# Altium project ECE453Tutorial.PrjPCB (part 1 of 2)
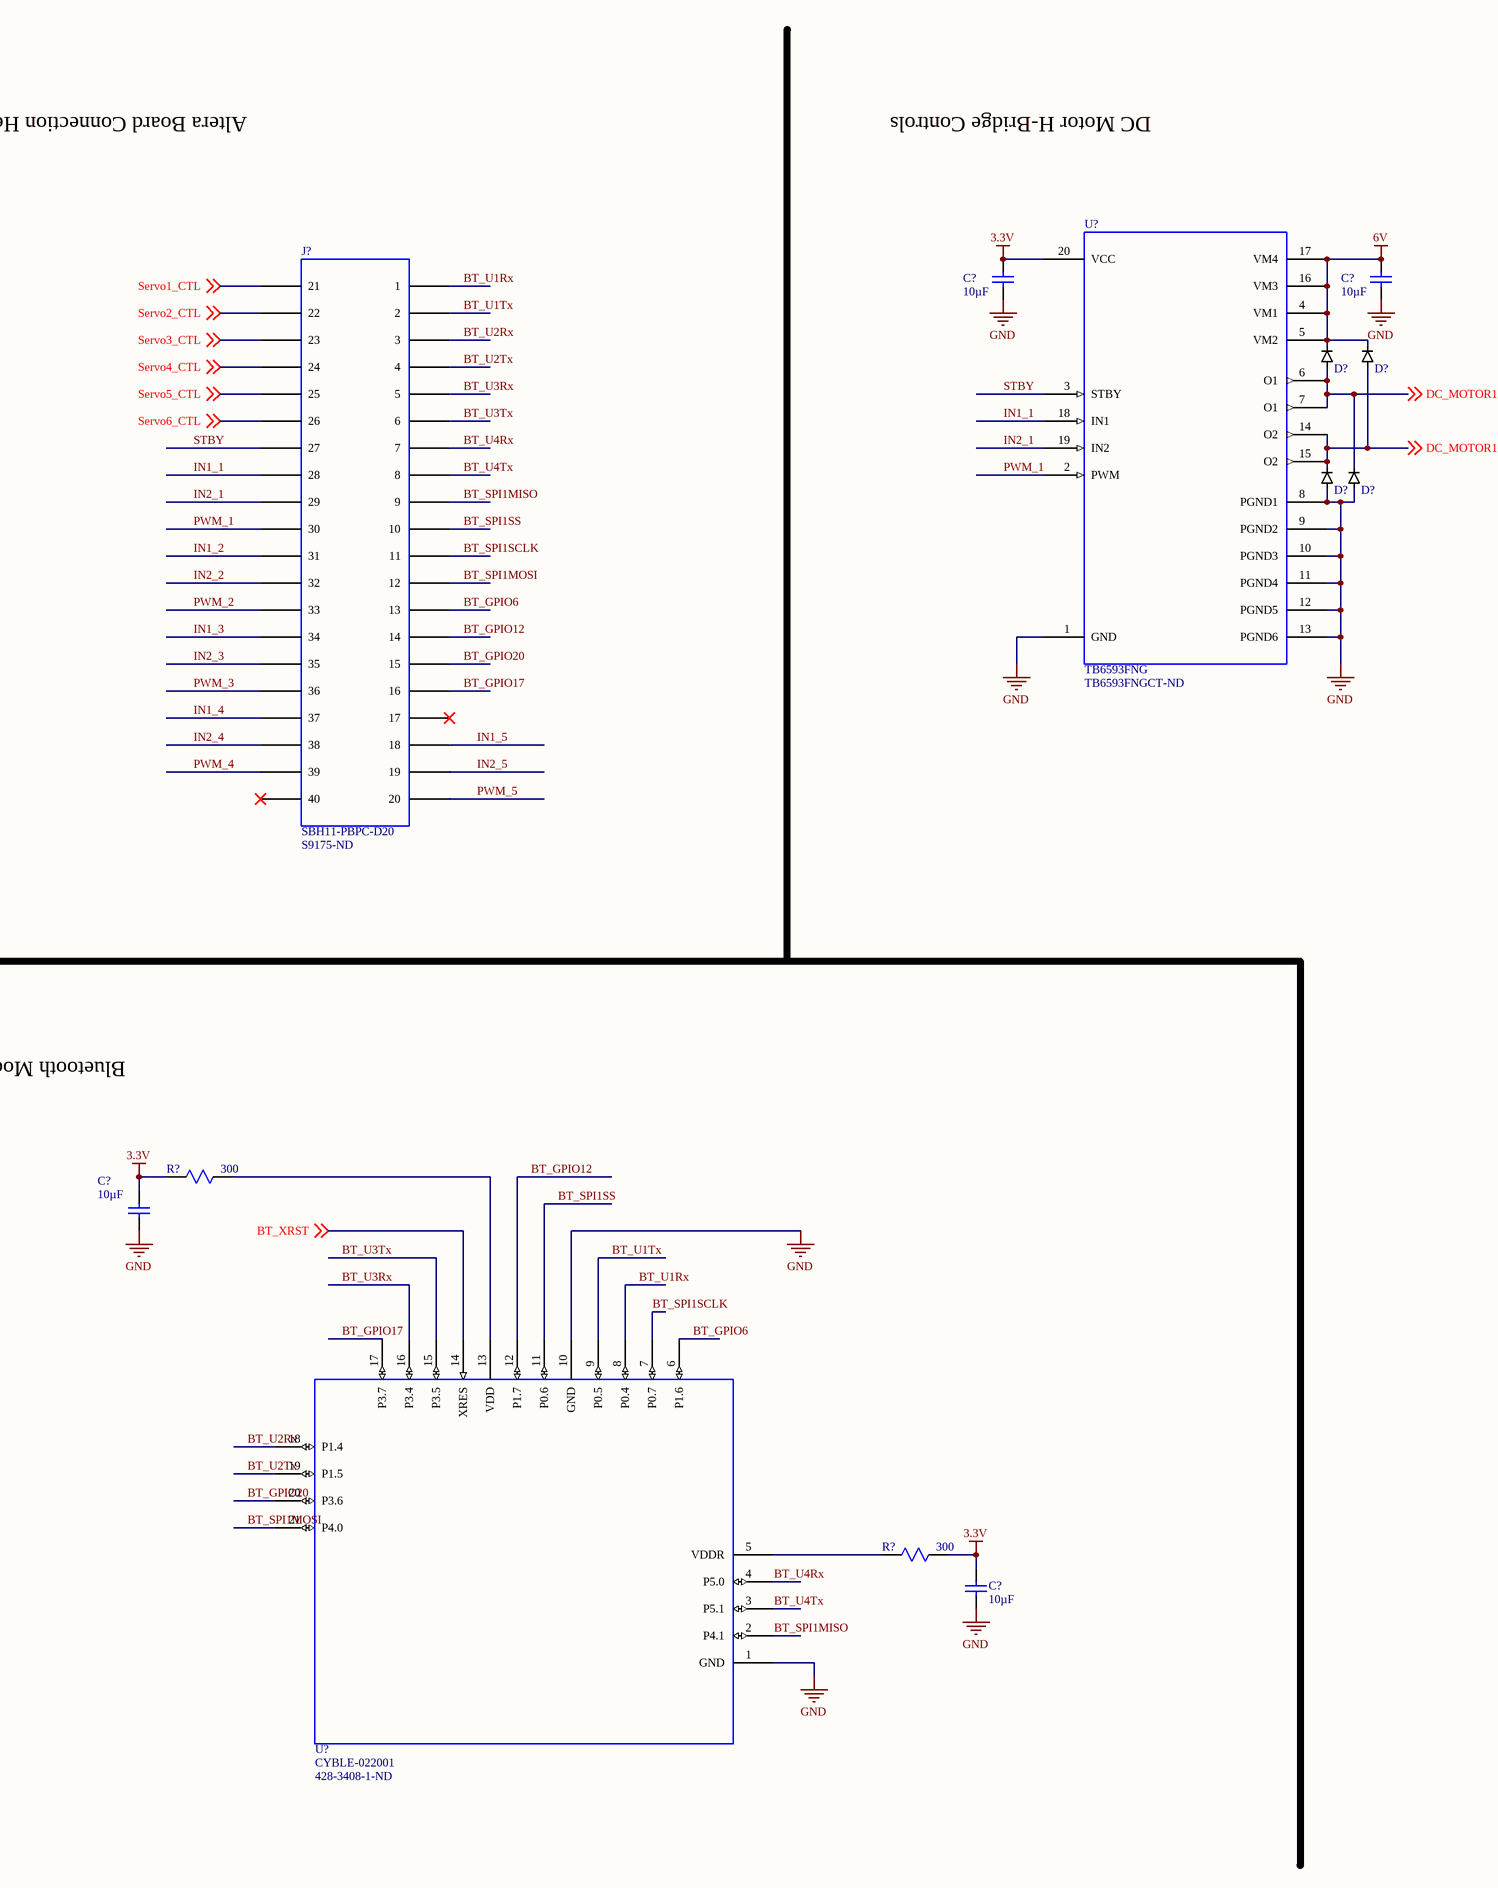
[diagram p0: 03 Arm Base Control Unit.SchDoc, left]
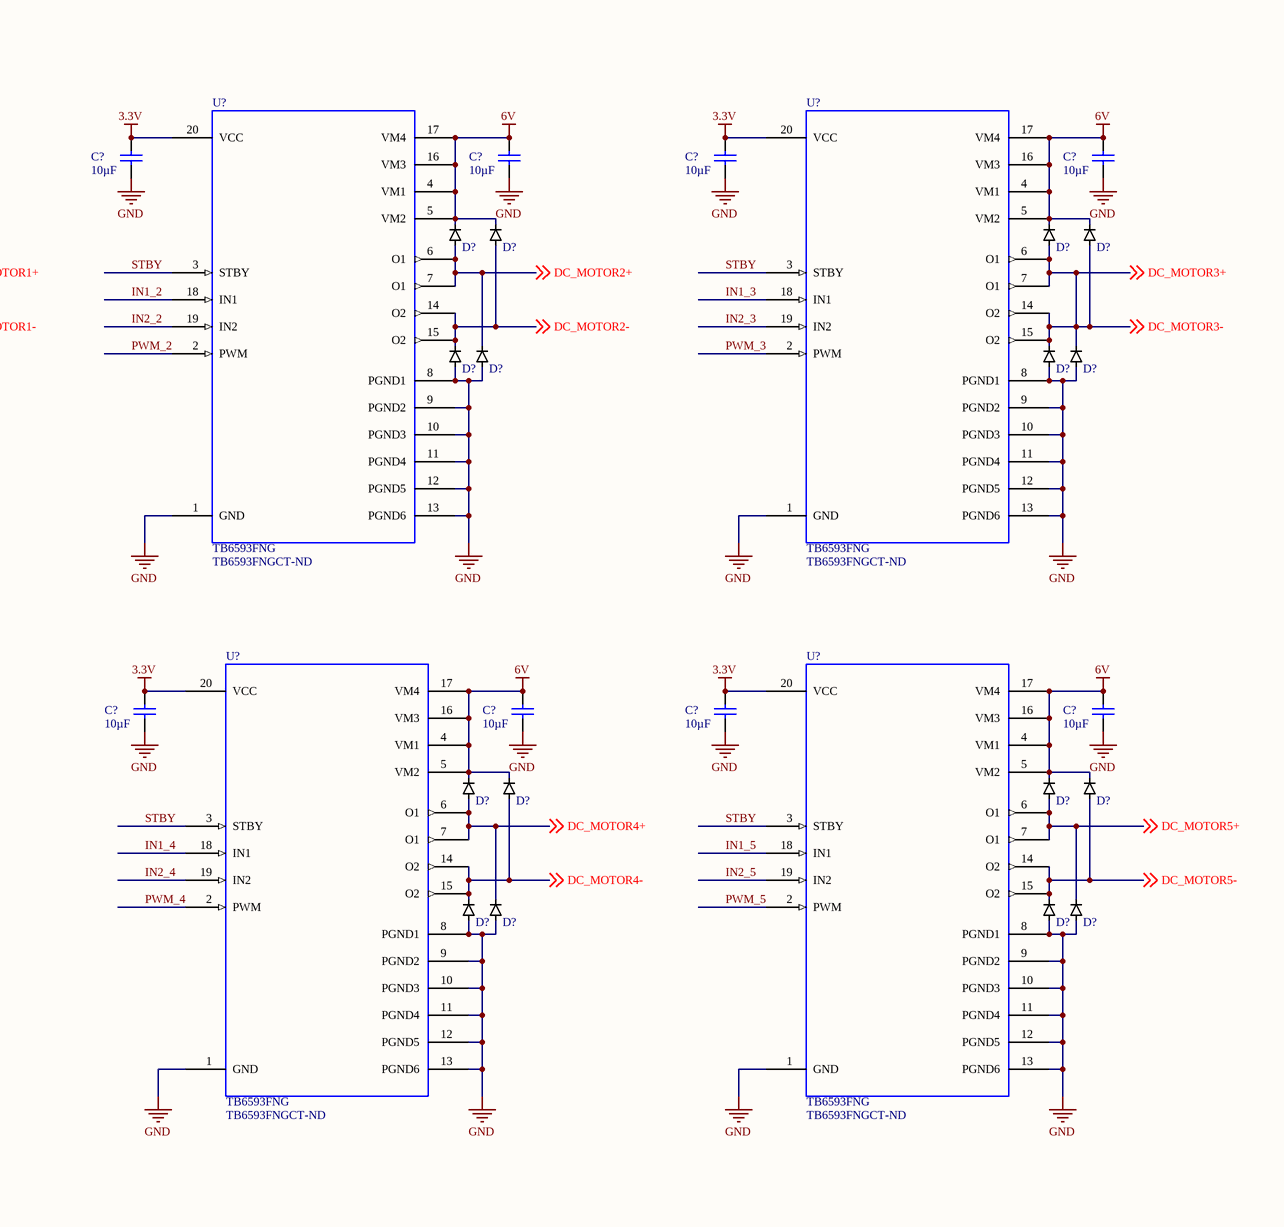
[diagram p1: 03 Arm Base Control Unit.SchDoc, right]
4 sheets, 150 parts. Net scope: global (net labels, ports and power ports of the same name join across sheets).
Board file: ECE453TutorialBoard.PcbDoc
Sheets:
  03 Arm Base Control Unit.SchDoc
  01 Revision History and Contents.SchDoc
  02 Motor Power Regulators and Connectors.SchDoc
  04 Glove Sensors.SchDoc

## Sheet 03 Arm Base Control Unit.SchDoc
size 558 x 355 mm

### Parts
(Parts that share a designator on the sheet are numbered #1, #2 ... from top to bottom, then left to right.)
C?#1  value 10µF  [CAP_0805]  (hidden comment: CAP_0805_U_010_00)
C?#2  value 10µF  [CAP_0805]  (hidden comment: CAP_0805_U_010_00)
C?#3  value 10µF  [CAP_0805]  (hidden comment: CAP_0805_U_010_00)
C?#4  value 10µF  [CAP_0805]  (hidden comment: CAP_0805_U_010_00)
C?#5  value 10µF  [CAP_0805]  (hidden comment: CAP_0805_U_010_00)
C?#6  value 10µF  [CAP_0805]  (hidden comment: CAP_0805_U_010_00)
C?#7  value 10µF  [CAP_0805]  (hidden comment: CAP_0805_U_010_00)
C?#8  value 10µF  [CAP_0805]  (hidden comment: CAP_0805_U_010_00)
C?#9  value 10µF  [CAP_0805]  (hidden comment: CAP_0805_U_010_00)
C?#10  value 10µF  [CAP_0805]  (hidden comment: CAP_0805_U_010_00)
C?#11  value 10µF  [CAP_0805]  (hidden comment: CAP_0805_U_010_00)
C?#12  value 10µF  [CAP_0805]  (hidden comment: CAP_0805_U_010_00)
D?#1  DB2W40100LCT-ND  (value not drawn)
D?#2  DB2W40100LCT-ND  (value not drawn)
D?#3  DB2W40100LCT-ND  (value not drawn)
D?#4  DB2W40100LCT-ND  (value not drawn)
D?#5  DB2W40100LCT-ND  (value not drawn)
D?#6  DB2W40100LCT-ND  (value not drawn)
D?#7  DB2W40100LCT-ND  (value not drawn)
D?#8  DB2W40100LCT-ND  (value not drawn)
D?#9  DB2W40100LCT-ND  (value not drawn)
D?#10  DB2W40100LCT-ND  (value not drawn)
D?#11  DB2W40100LCT-ND  (value not drawn)
D?#12  DB2W40100LCT-ND  (value not drawn)
D?#13  DB2W40100LCT-ND  (value not drawn)
D?#14  DB2W40100LCT-ND  (value not drawn)
D?#15  DB2W40100LCT-ND  (value not drawn)
D?#16  DB2W40100LCT-ND  (value not drawn)
D?#17  DB2W40100LCT-ND  (value not drawn)
D?#18  DB2W40100LCT-ND  (value not drawn)
D?#19  DB2W40100LCT-ND  (value not drawn)
D?#20  DB2W40100LCT-ND  (value not drawn)
J?#1  value SBH11-PBPC-D20  Supplier Part Number 1: S9175-ND  (hidden comment: SBH11-PBPC-D20-ST-BK)
R?#1  value 300  (hidden comment: RC0402JR-07300RL)
R?#2  value 300  (hidden comment: RC0402JR-07300RL)
U?#1  Supplier Part Number 1: TB6593FNGCT-ND  (hidden comment: TB6593FNG)
U?#2  Supplier Part Number 1: TB6593FNGCT-ND  (hidden comment: TB6593FNG)
U?#3  Supplier Part Number 1: TB6593FNGCT-ND  (hidden comment: TB6593FNG)
U?#4  Supplier Part Number 1: TB6593FNGCT-ND  (hidden comment: TB6593FNG)
U?#5  Supplier Part Number 1: TB6593FNGCT-ND  (hidden comment: TB6593FNG)
U?#6  value CYBLE-022001  Supplier Part Number 1: 428-3408-1-ND  (hidden comment: CYBLE-022001-00)

### Nets
3.3V: C?#1.2 C?#3.2 C?#5.2 C?#7.2 C?#9.2 C?#11.2 C?#12.2 R?#1.1 R?#2.2 U?#1.20(VCC) U?#2.20(VCC) U?#3.20(VCC) U?#4.20(VCC) U?#5.20(VCC)
6V: C?#2.2 C?#4.2 C?#6.2 C?#8.2 C?#10.2 D?#1.41 D?#2.41 D?#3.41 D?#4.41 D?#5.41 D?#6.41 D?#13.41 D?#14.41 D?#15.41 D?#16.41 U?#1.4(VM1) U?#1.5(VM2) U?#1.16(VM3) U?#1.17(VM4) U?#2.4(VM1) U?#2.5(VM2) U?#2.16(VM3) U?#2.17(VM4) U?#3.4(VM1) U?#3.5(VM2) U?#3.16(VM3) U?#3.17(VM4) U?#4.4(VM1) U?#4.5(VM2) U?#4.16(VM3) U?#4.17(VM4) U?#5.4(VM1) U?#5.5(VM2) U?#5.16(VM3) U?#5.17(VM4)  [project net Vout]
GND: C?#1.1 C?#2.1 C?#3.1 C?#4.1 C?#5.1 C?#6.1 C?#7.1 C?#8.1 C?#9.1 C?#10.1 C?#11.1 C?#12.1 D?#7.42 D?#8.42 D?#9.42 D?#10.42 D?#11.42 D?#12.42 D?#17.42 D?#18.42 D?#19.42 D?#20.42 U?#1.1(GND) U?#1.8(PGND1) U?#1.9(PGND2) U?#1.10(PGND3) U?#1.11(PGND4) U?#1.12(PGND5) U?#1.13(PGND6) U?#2.1(GND) U?#2.8(PGND1) U?#2.9(PGND2) U?#2.10(PGND3) U?#2.11(PGND4) U?#2.12(PGND5) U?#2.13(PGND6) U?#3.1(GND) U?#3.8(PGND1) U?#3.9(PGND2) U?#3.10(PGND3) U?#3.11(PGND4) U?#3.12(PGND5) U?#3.13(PGND6) U?#4.1(GND) U?#4.8(PGND1) U?#4.9(PGND2) U?#4.10(PGND3) U?#4.11(PGND4) U?#4.12(PGND5) U?#4.13(PGND6) U?#5.1(GND) U?#5.8(PGND1) U?#5.9(PGND2) U?#5.10(PGND3) U?#5.11(PGND4) U?#5.12(PGND5) U?#5.13(PGND6) U?#6.1(GND) U?#6.10(GND)  [project net BAT_GND]
BT_GPIO6: J?#1.13 U?#6.6(P1.6)
BT_GPIO12: J?#1.14 U?#6.12(P1.7)
BT_GPIO17: J?#1.16 U?#6.17(P3.7)
BT_GPIO20: J?#1.15 U?#6.20(P3.6)
BT_SPI1MISO: J?#1.9 U?#6.2(P4.1)
BT_SPI1MOSI: J?#1.12 U?#6.21(P4.0)
BT_SPI1SCLK: J?#1.11 U?#6.7(P0.7)
BT_SPI1SS: J?#1.10 U?#6.11(P0.6)
BT_U1Rx: J?#1.1 U?#6.8(P0.4)
BT_U1Tx: J?#1.2 U?#6.9(P0.5)
BT_U2Rx: J?#1.3 U?#6.18(P1.4)
BT_U2Tx: J?#1.4 U?#6.19(P1.5)
BT_U3Rx: J?#1.5 U?#6.16(P3.4)
BT_U3Tx: J?#1.6 U?#6.15(P3.5)
BT_U4Rx: J?#1.7 U?#6.4(P5.0)
BT_U4Tx: J?#1.8 U?#6.3(P5.1)
BT_XRST: U?#6.14(XRES) ; off-sheet BT_XRST
DC_MOTOR1+: D?#1.42 D?#8.41 U?#1.6(O1) U?#1.7(O1) ; off-sheet DC_MOTOR1+
DC_MOTOR1-: D?#2.42 D?#7.41 U?#1.14(O2) U?#1.15(O2) ; off-sheet DC_MOTOR1-
DC_MOTOR2+: D?#3.42 D?#10.41 U?#2.6(O1) U?#2.7(O1) ; off-sheet DC_MOTOR2+
DC_MOTOR2-: D?#4.42 D?#9.41 U?#2.14(O2) U?#2.15(O2) ; off-sheet DC_MOTOR2-
DC_MOTOR3+: D?#5.42 D?#6.42 D?#11.41 D?#12.41 U?#3.6(O1) U?#3.7(O1) U?#3.14(O2) U?#3.15(O2) ; off-sheet DC_MOTOR3+, off-sheet DC_MOTOR3-  [also labelled DC_MOTOR3-]
DC_MOTOR4+: D?#13.42 D?#18.41 U?#4.6(O1) U?#4.7(O1) ; off-sheet DC_MOTOR4+
DC_MOTOR4-: D?#14.42 D?#17.41 U?#4.14(O2) U?#4.15(O2) ; off-sheet DC_MOTOR4-
DC_MOTOR5+: D?#15.42 D?#20.41 U?#5.6(O1) U?#5.7(O1) ; off-sheet DC_MOTOR5+
DC_MOTOR5-: D?#16.42 D?#19.41 U?#5.14(O2) U?#5.15(O2) ; off-sheet DC_MOTOR5-
IN1_1: J?#1.28 U?#1.18(IN1)
IN1_2: J?#1.31 U?#2.18(IN1)
IN1_3: J?#1.34 U?#3.18(IN1)
IN1_4: J?#1.37 U?#4.18(IN1)
IN1_5: J?#1.18 U?#5.18(IN1)
IN2_1: J?#1.29 U?#1.19(IN2)
IN2_2: J?#1.32 U?#2.19(IN2)
IN2_3: J?#1.35 U?#3.19(IN2)
IN2_4: J?#1.38 U?#4.19(IN2)
IN2_5: J?#1.19 U?#5.19(IN2)
PWM_1: J?#1.30 U?#1.2(PWM)
PWM_2: J?#1.33 U?#2.2(PWM)
PWM_3: J?#1.36 U?#3.2(PWM)
PWM_4: J?#1.39 U?#4.2(PWM)
PWM_5: J?#1.20 U?#5.2(PWM)
Servo1_CTL: J?#1.21 ; off-sheet Servo1_CTL
Servo2_CTL: J?#1.22 ; off-sheet Servo2_CTL
Servo3_CTL: J?#1.23 ; off-sheet Servo3_CTL
Servo4_CTL: J?#1.24 ; off-sheet Servo4_CTL
Servo5_CTL: J?#1.25 ; off-sheet Servo5_CTL
Servo6_CTL: J?#1.26 ; off-sheet Servo6_CTL
STBY: J?#1.27 U?#1.3(STBY) U?#2.3(STBY) U?#3.3(STBY) U?#4.3(STBY) U?#5.3(STBY)
NetR?#1_2: R?#1.2 U?#6.13(VDD)
NetR?#2_1: R?#2.1 U?#6.5(VDDR)

Not connected (* = marked no-connect by the designer): J?#1 17* 40*

### Notes on the sheet
- Altera Board Connection Header
- DC Motor H-Bridge Controls
- Bluetooth Module

### Library data of the parts
C?#1-C?#12 = CAP_0805_U_010_00: CAP CER 10UF 10V X5R 0805; Manufacturer: Samsung Electro-Mechanics America, Inc.; Manufacturer Part Number: CL21A106KPCLQNC; Tolerance: ±10%; Supplier 1: Digi-Key; Supplier Part Number 1: 1276-2402-1-ND; RoHS: RoHS Compliant; Category: Capacitors; Stock 1: 97192; Pricing 1: 1=0.2, 10=0.14, 25=0.1052, 50=0.0806, 100=0.0665, 500=0.0469, 1000=0.0385 (USD); Packaging: Cut Tape (CT); Voltage - Rated: 10V; Temperature Coefficient: X5R; Mounting Type: Surface Mount, MLCC; Operating Temperature: -55°C ~ 85°C; Applications: General Purpose; Ratings: -; Package / Case: 0805 (2012 Metric); Size / Dimension: 0.079" L x 0.049" W (2.00mm x 1.25mm); Height - Seated (Max): -; Thickness (Max): 0.037" (0.95mm); Lead Spacing: -; Features: -; Lead Style: -; ComponentLink1URL: http://media.digikey.com/pdf/Data%20Sheets/Samsung%20PDFs/CL21A106KPCLQNC_character.pdf; ComponentLink1Description: http://media.digikey.com/pdf/Data%20Sheets/Samsung%20PDFs/CL21A106KPCLQNC_character.pdf
D?#1-D?#20 = DB2W40100LCT-ND: Diode 1A; Manufacturer: Panasonic Electronic Components; Diode Type: Standard; Voltage - DC Reverse (Vr) (Max): 40V; Current - Average Rectified (Io): 1A (DC); Voltage - Forward (Vf) (Max) @ If: 390mV @ 1A; Speed: Fast Recovery =< 500ns, > 200mA (Io); Reverse Recovery Time (trr): 15ns; Current - Reverse Leakage @ Vr: 250µA @ 40V; Capacitance @ Vr, F: 50pF @ 10V, 1MHz; Supplier 1: Digi-Key; Manufacturer Part Number: DB2W40100L; RoHS: RoHS Compliant; Category: Discrete Semiconductor Products; Stock 1: 4900; Pricing 1: 1=0.2, 10=0.174, 25=0.1396, 100=0.1086, 250=0.10548, 500=0.10236, 1000=0.09306 (USD); Packaging: Cut Tape (CT); Mounting Type: Surface Mount; Package / Case: SOD-123F; Supplier Device Package: Mini2-F3-B; Operating Temperature - Junction: 150°C (Max); ComponentLink1URL: http://industrial.panasonic.com/www-cgi/jvcr13pz.cgi?E+SC+4+CDF7001+DB2W401+8+WW; ComponentLink1Description: http://industrial.panasonic.com/www-cgi/jvcr13pz.cgi?E+SC+4+CDF7001+DB2W401+8+WW; Supplier Part Number 1: DB2W40100LCT-ND
J?#1 = SBH11-PBPC-D20-ST-BK: 40 PIN BOX HEADER LINE; Manufacturer: Sullins Connector Solutions; Connector Type: Header, Shrouded; Number of Positions: 40; Number of Positions Loaded: All; Pitch: 0.100" (2.54mm); Supplier 1: Digi-Key; Manufacturer Part Number: SBH11-PBPC-D20-ST-BK; RoHS: RoHS Compliant; Category: Connectors, Interconnects; Stock 1: 2900; Pricing 1: 1=0.91, 10=0.753, 25=0.6976, 50=0.6278, 100=0.558, 250=0.48824, 500=0.4464, 1000=0.40455, 2500=0.3627 (USD); Packaging: Tray; Contact Type: Male Pin; Number of Rows: 2; Row Spacing: 0.100" (2.54mm); Contact Mating Length: -; Mounting Type: Through Hole; Termination: Solder; Fastening Type: -; Features: Polarizing Key; Contact Finish: Gold; Contact Finish Thickness: Flash; Color: Black; ComponentLink1URL: http://sullinscorp.com/catalogs/145_PAGE118_.100_SBH11_SERIES_MALE_BOX_HDR_ST_RA_SMT.pdf; ComponentLink1Description: http://sullinscorp.com/catalogs/145_PAGE118_.100_SBH11_SERIES_MALE_BOX_HDR_ST_RA_SMT.pdf
R?#1 R?#2 = RC0402JR-07300RL: RES SMD 300 OHM 5%; Manufacturer: Yageo; Power (Watts): 0.063W, 1/16W; Temperature Coefficient: ±100ppm/°C; Supplier 1: Digi-Key; Manufacturer Part Number: RC0402JR-07300RL; RoHS: RoHS Compliant; Category: Resistors; Stock 1: 32725; Pricing 1: 1=0.1, 10=0.012, 25=0.0084, 100=0.0047, 250=0.0036, 500=0.0029, 1000=0.00213, 2500=0.00185, 5000=0.00153 (USD); Packaging: Cut Tape (CT); Resistance (Ohms): 300; Tolerance: ±5%; Composition: Thick Film; Features: Moisture Resistant; Operating Temperature: -55°C ~ 155°C; Package / Case: 0402 (1005 Metric); Supplier Device Package: 0402; Size / Dimension: 0.039" L x 0.020" W (1.00mm x 0.50mm); Height: 0.016" (0.40mm); Number of Terminations: 2; ComponentLink1URL: http://www.yageo.com/NewPortal/yageodocoutput?fileName=/pdf/R-Chip/PYu-RC_Group_51_RoHS_L_3.pdf; ComponentLink1Description: http://www.yageo.com/NewPortal/yageodocoutput?fileName=/pdf/R-Chip/PYu-RC_Group_51_RoHS_L_3.pdf; Supplier Part Number 1: 311-300JRCT-ND
U?#1-U?#5 = TB6593FNG: DC Motor Driver IC; Manufacturer: Toshiba Semiconductor and Storage; Manufacturer Part Number: TB6593FNG(O,EL); Motor Type - AC, DC: Brushed DC; Function: Driver - Fully Integrated, Control and Power Stage; Output Configuration: Half Bridge (2); Interface: PWM; Current - Output: 1A; Voltage - Supply: 2.7 V ~ 5.5 V; Voltage - Load: 2.5 V ~ 13.5 V; Supplier 1: Digi-Key; RoHS: RoHS Compliant; Category: Integrated Circuits (ICs); Stock 1: 2894; Pricing 1: 1=2.65, 10=2.39, 25=2.1416, 100=1.9256, 250=1.7098, 500=1.494, 1000=1.2367 (USD); Packaging: Cut Tape (CT); Motor Type - Stepper: -; Technology: Power MOSFET; Step Resolution: -; Applications: General Purpose; Operating Temperature: -20°C ~ 85°C (TA); Mounting Type: Surface Mount; Package / Case: 20-LSSOP (0.173", 4.40mm Width); Supplier Device Package: 20-SSOP; ComponentLink1URL: http://toshiba.semicon-storage.com/info/docget.jsp?did=10658&prodName=TB6593FNG; ComponentLink1Description: http://toshiba.semicon-storage.com/info/docget.jsp?did=10658&prodName=TB6593FNG; Value: TB6593FNG
U?#6 = CYBLE-022001-00: EZ-BLE PRoC Module; Manufacturer: Cypress Semiconductor Corp; RF Family/Standard: Bluetooth; Protocol: Bluetooth v4.1 Low Energy (BLE); Frequency: 2.4GHz; Data Rate: 1Mbps; Power - Output: 3dBm; Sensitivity: -91dBm; Serial Interfaces: I²C, SPI, UART; Antenna Type: Integrated, Chip; Memory Size: 128kB Flash, 16kB SRAM; Voltage - Supply: 1.8 V ~ 4.5 V; Current - Receiving: 16.4mA; Current - Transmitting: 15.6mA; Supplier 1: Digi-Key; Manufacturer Part Number: CYBLE-022001-00; RoHS: RoHS Compliant; Category: RF/IF and RFID; Stock 1: 1211; Pricing 1: 1=11.9, 25=10.0084, 100=9.4675, 250=8.656 (USD); Packaging: Cut Tape (CT); Modulation: -; Mounting Type: Surface Mount; Operating Temperature: -40°C ~ 85°C; Package / Case: Module; ComponentLink1URL: http://www.cypress.com/file/140791/download; ComponentLink1Description: http://www.cypress.com/file/140791/download

## Sheet 01 Revision History and Contents.SchDoc: ECE453TutorialBoard
size B; DrawnBy: JMP; Engineer: JMP; ProjectName: ECE453TutorialBoard
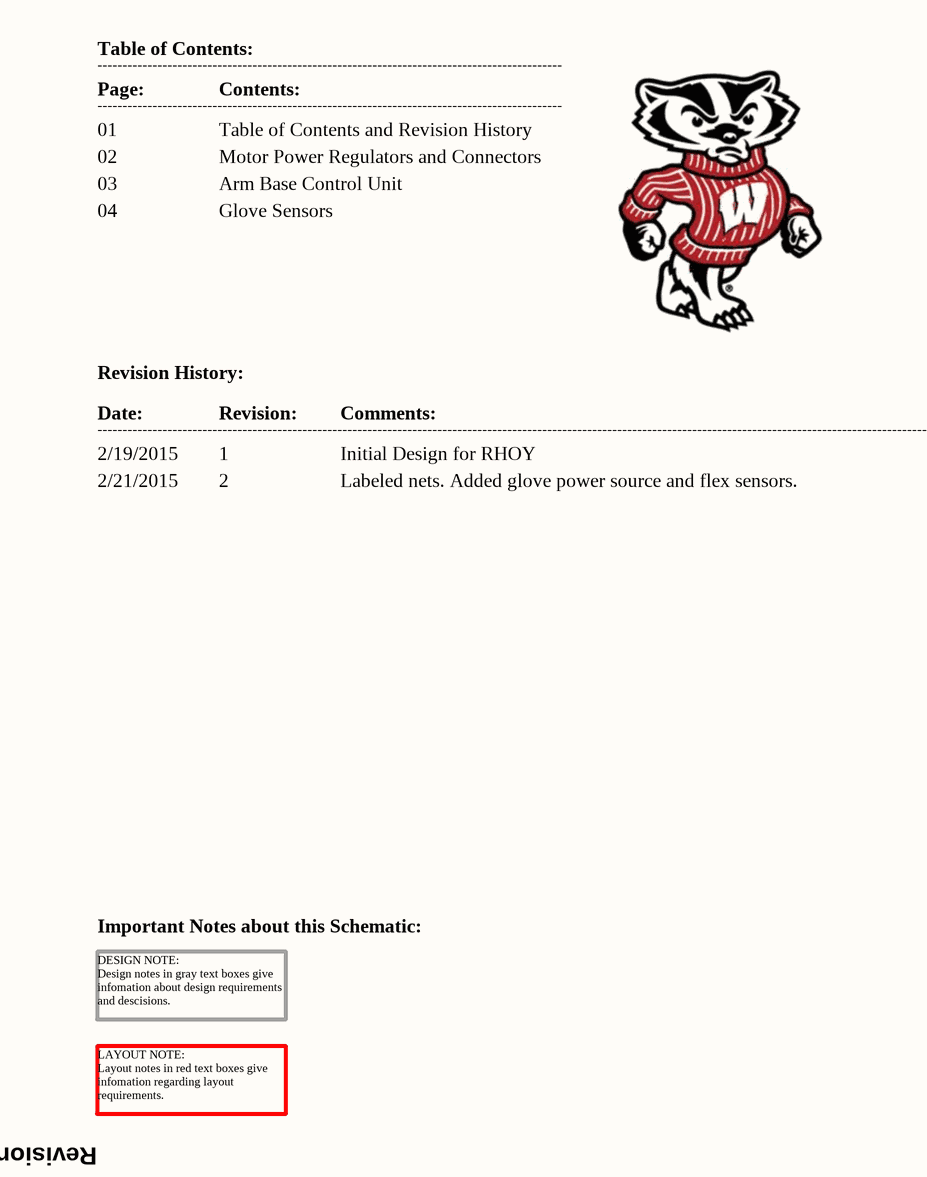
[diagram p2: 01 Revision History and Contents.SchDoc, left]
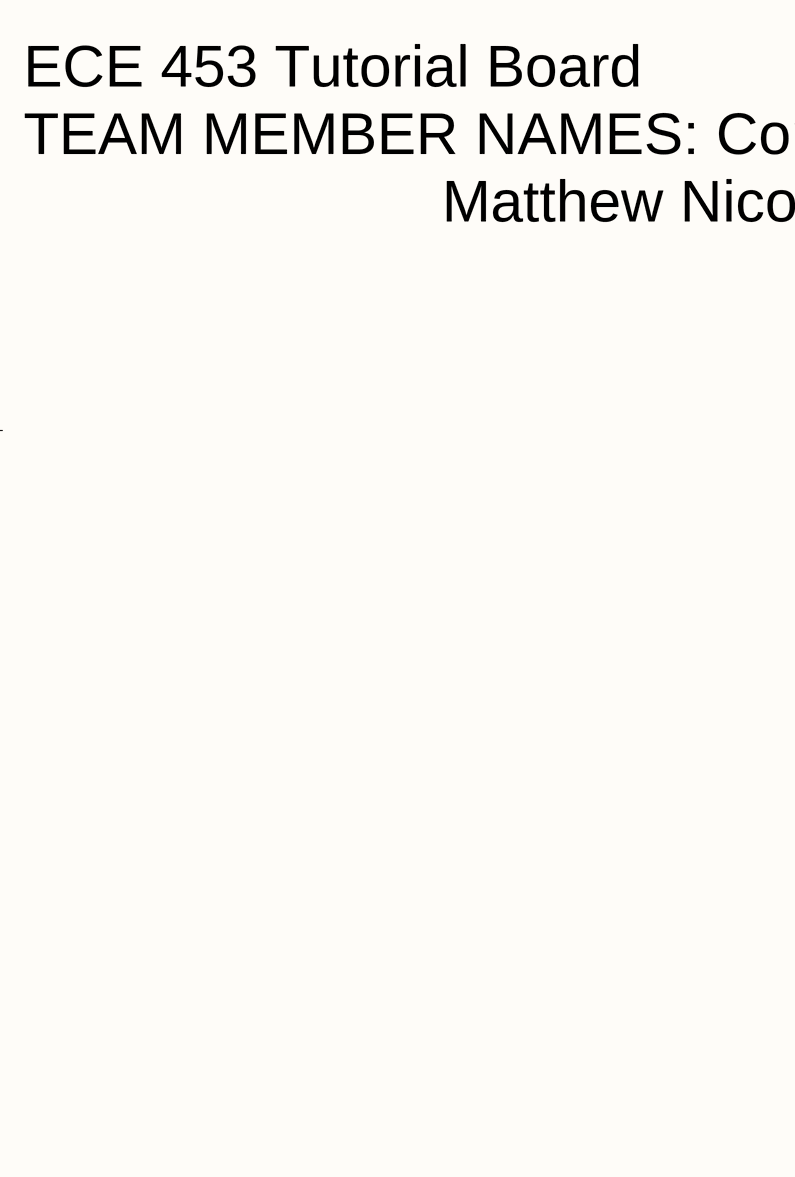
[diagram p3: 01 Revision History and Contents.SchDoc, right]

### Notes on the sheet
- Table of Contents:
- Page:
- ---------------------------------------------------------------------------------------------
- Contents:
- ECE 453 Tutorial Board
- 01
- 02
- 03
- Table of Contents and Revision History
- Motor Power Regulators and Connectors
- Arm Base Control Unit
- TEAM MEMBER NAMES: Conner Huff, Tiffany Voss,
- 04
- Glove Sensors
- Matthew Nicol, Nick Koxlien
- Revision History:
- Date:
- 2/19/2015
- ----------------------------------------------------------------------------------------------------------------------------------------------------------------------
- Revision:
- 1
- Comments:
- Initial Design for RHOY
- 2/21/2015
- 2
- Labeled nets. Added glove power source and flex sensors.
- Important Notes about this Schematic:
- DESIGN NOTE:
  Design notes in gray text boxes give infomation about design requirements and descisions.
- Revision History and Table of Contents
- LAYOUT NOTE:
  Layout notes in red text boxes give infomation regarding layout requirements.

## Sheet 02 Motor Power Regulators and Connectors.SchDoc
size 381 x 508 mm
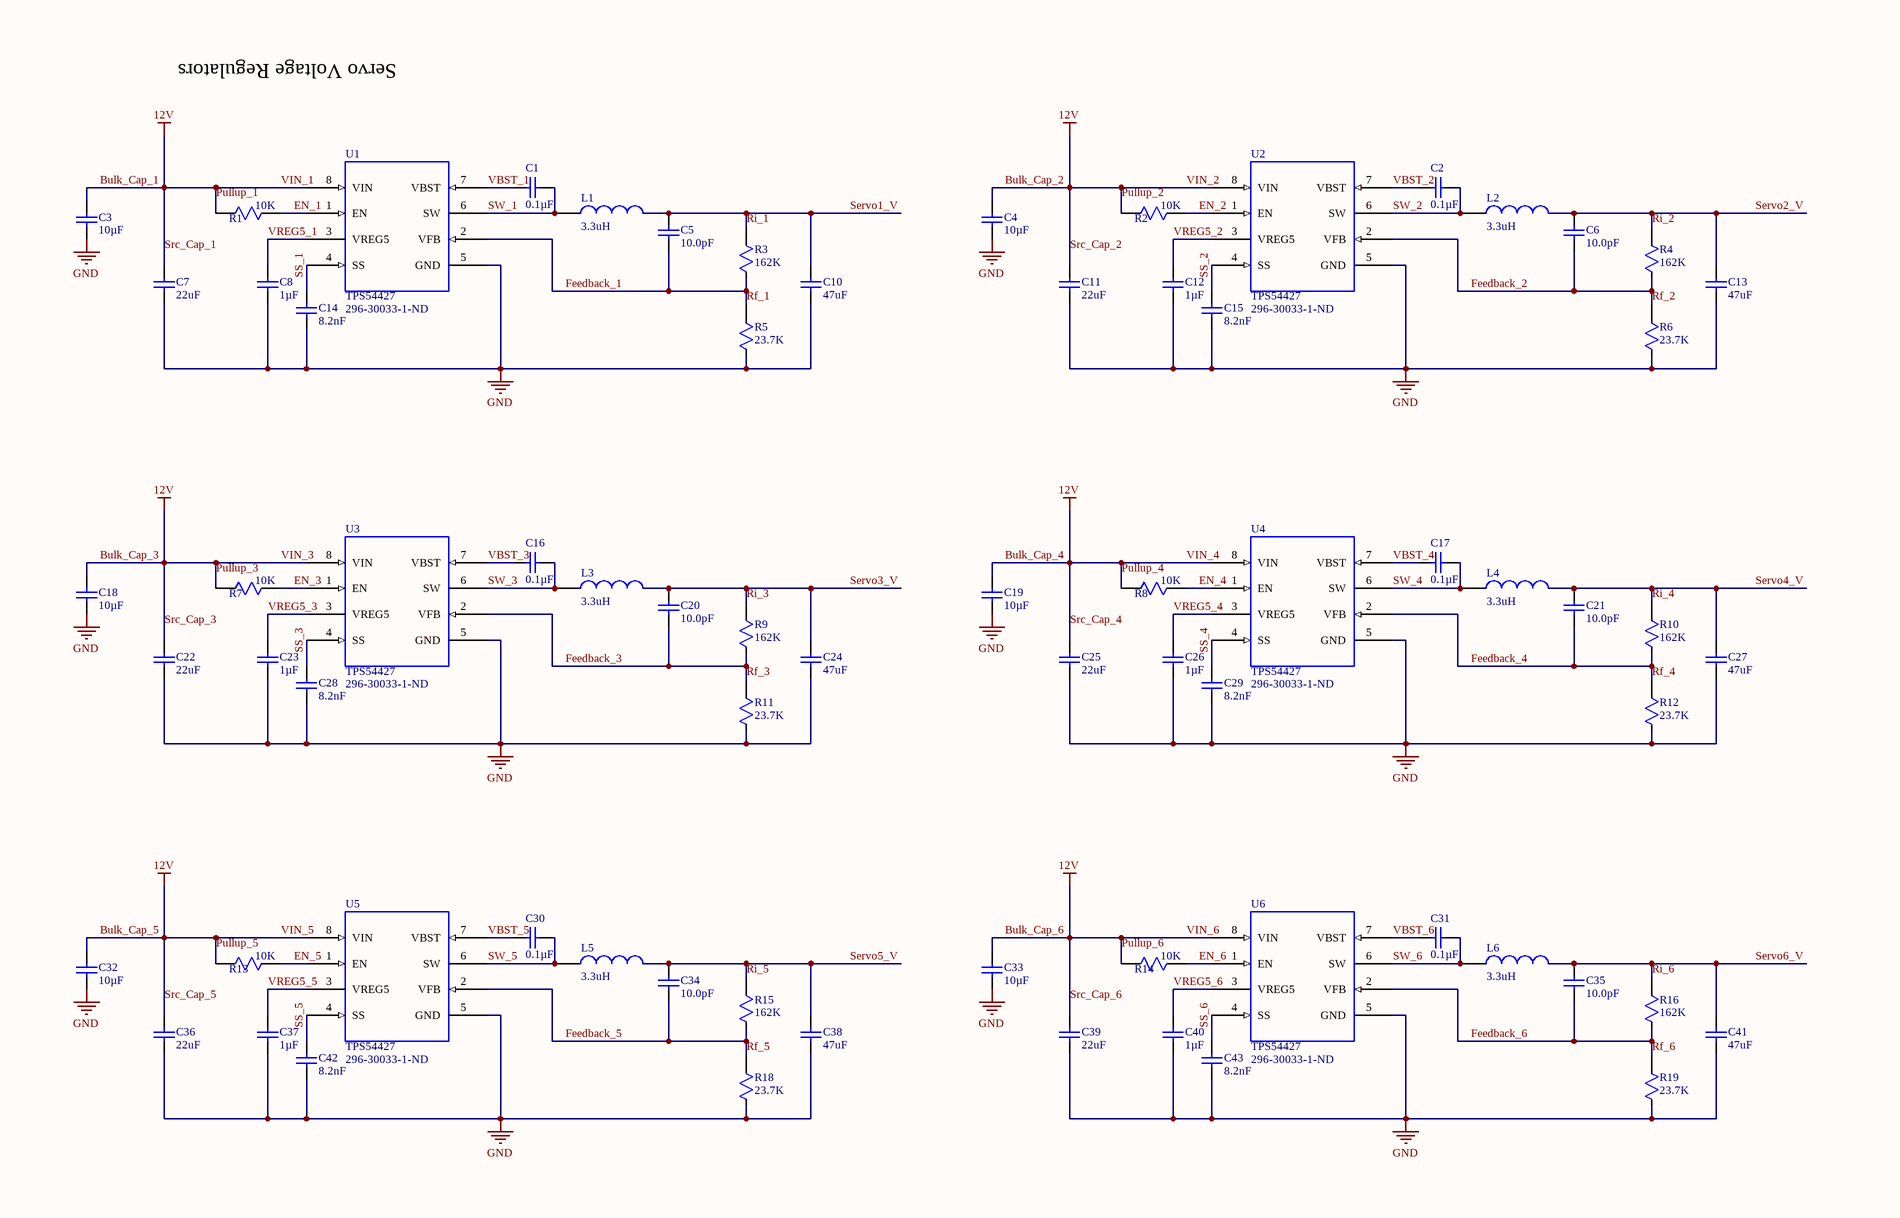
[diagram p4: 02 Motor Power Regulators and Connectors.SchDoc, top]
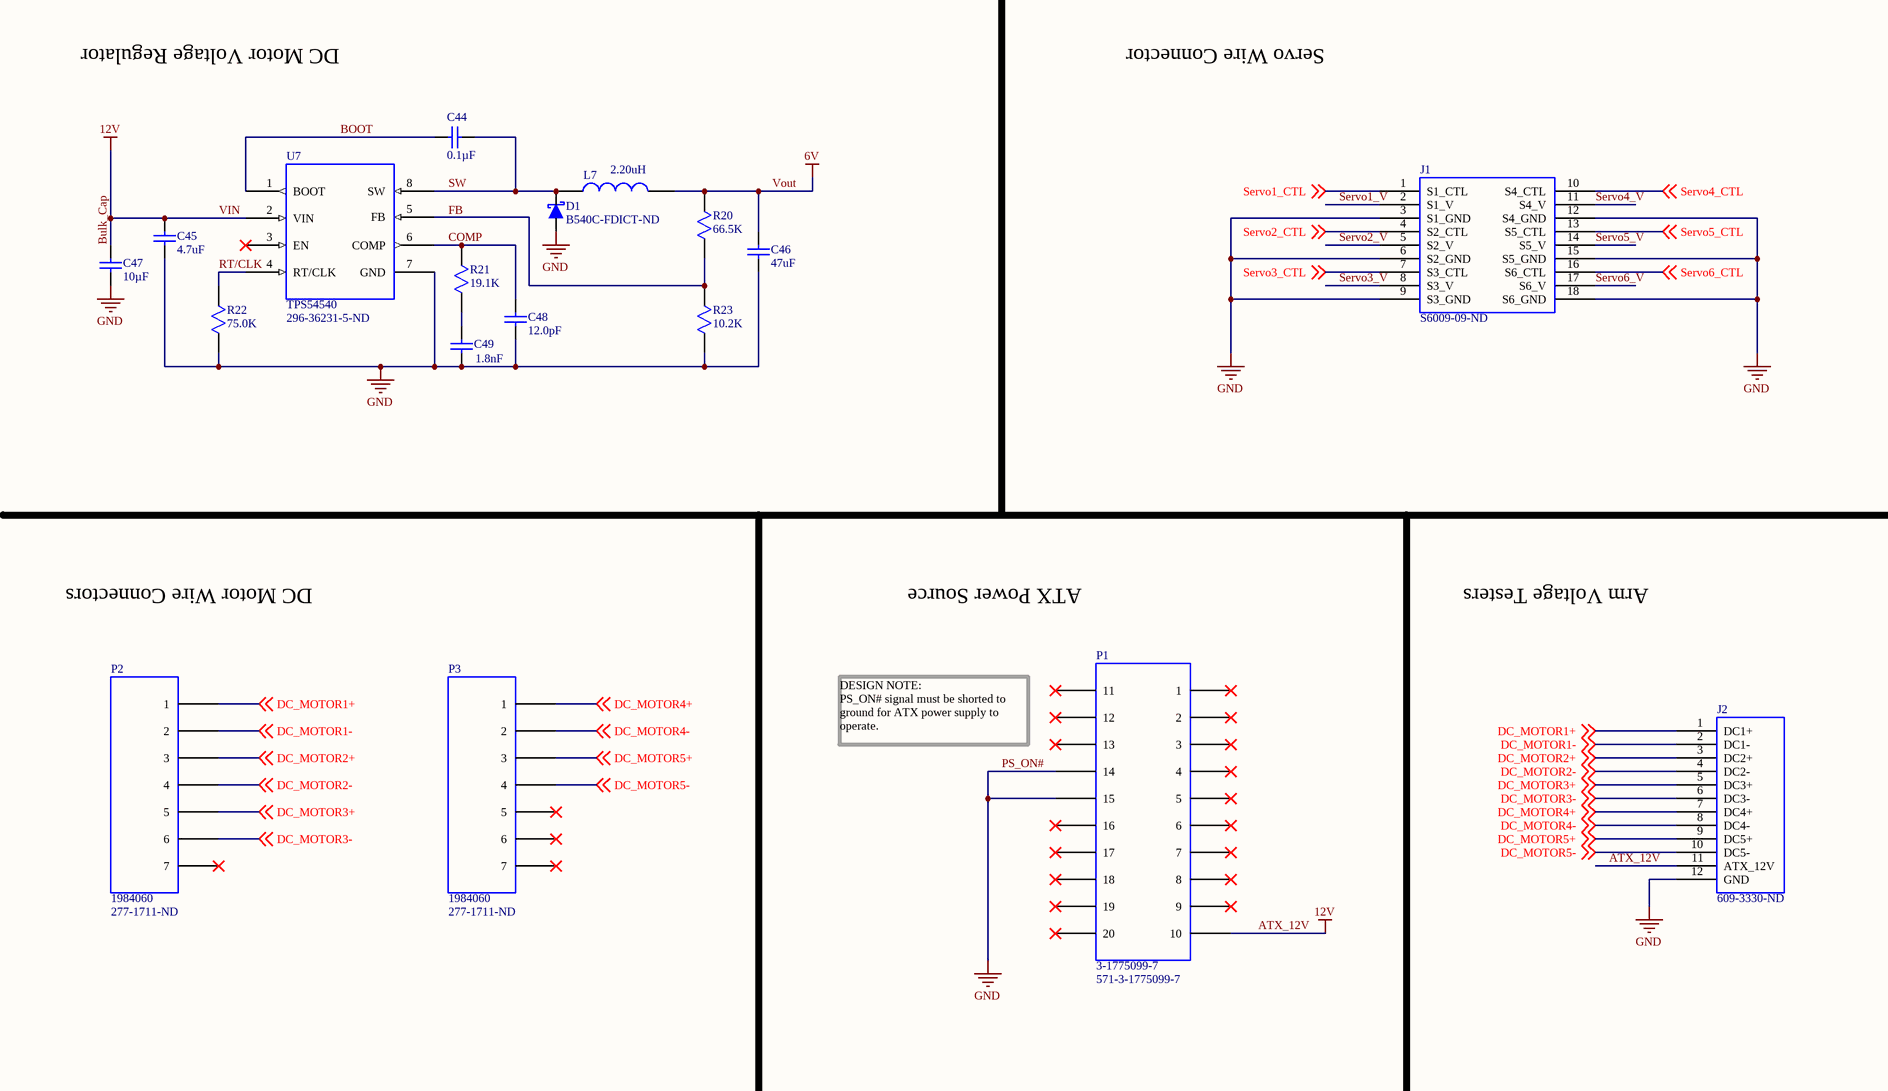
[diagram p5: 02 Motor Power Regulators and Connectors.SchDoc, bottom]

### Parts
C1  value 0.1µF  [CAP_0805]  (hidden comment: CAP_0805_U_000_10)
C2  value 0.1µF  [CAP_0805]  (hidden comment: CAP_0805_U_000_10)
C3  value 10µF  [CAP_0805]  (hidden comment: CAP_0805_U_010_00)
C4  value 10µF  [CAP_0805]  (hidden comment: CAP_0805_U_010_00)
C5  value 10.0pF  (hidden comment: CAP_10_pF)
C6  value 10.0pF  (hidden comment: CAP_10_pF)
C7  value 22uF  (hidden comment: CAP_22_uF)
C8  value 1µF  [CAP_0805]  (hidden comment: CAP_0805_U_001_00)
C10  value 47uF  (hidden comment: CAP_47_uF)
C11  value 22uF  (hidden comment: CAP_22_uF)
C12  value 1µF  [CAP_0805]  (hidden comment: CAP_0805_U_001_00)
C13  value 47uF  (hidden comment: CAP_47_uF)
C14  value 8.2nF  (hidden comment: CAP_8.2_nF)
C15  value 8.2nF  (hidden comment: CAP_8.2_nF)
C16  value 0.1µF  [CAP_0805]  (hidden comment: CAP_0805_U_000_10)
C17  value 0.1µF  [CAP_0805]  (hidden comment: CAP_0805_U_000_10)
C18  value 10µF  [CAP_0805]  (hidden comment: CAP_0805_U_010_00)
C19  value 10µF  [CAP_0805]  (hidden comment: CAP_0805_U_010_00)
C20  value 10.0pF  (hidden comment: CAP_10_pF)
C21  value 10.0pF  (hidden comment: CAP_10_pF)
C22  value 22uF  (hidden comment: CAP_22_uF)
C23  value 1µF  [CAP_0805]  (hidden comment: CAP_0805_U_001_00)
C24  value 47uF  (hidden comment: CAP_47_uF)
C25  value 22uF  (hidden comment: CAP_22_uF)
C26  value 1µF  [CAP_0805]  (hidden comment: CAP_0805_U_001_00)
C27  value 47uF  (hidden comment: CAP_47_uF)
C28  value 8.2nF  (hidden comment: CAP_8.2_nF)
C29  value 8.2nF  (hidden comment: CAP_8.2_nF)
C30  value 0.1µF  [CAP_0805]  (hidden comment: CAP_0805_U_000_10)
C31  value 0.1µF  [CAP_0805]  (hidden comment: CAP_0805_U_000_10)
C32  value 10µF  [CAP_0805]  (hidden comment: CAP_0805_U_010_00)
C33  value 10µF  [CAP_0805]  (hidden comment: CAP_0805_U_010_00)
C34  value 10.0pF  (hidden comment: CAP_10_pF)
C35  value 10.0pF  (hidden comment: CAP_10_pF)
C36  value 22uF  (hidden comment: CAP_22_uF)
C37  value 1µF  [CAP_0805]  (hidden comment: CAP_0805_U_001_00)
C38  value 47uF  (hidden comment: CAP_47_uF)
C39  value 22uF  (hidden comment: CAP_22_uF)
C40  value 1µF  [CAP_0805]  (hidden comment: CAP_0805_U_001_00)
C41  value 47uF  (hidden comment: CAP_47_uF)
C42  value 8.2nF  (hidden comment: CAP_8.2_nF)
C43  value 8.2nF  (hidden comment: CAP_8.2_nF)
C44  value 0.1µF  [CAP_0805]  (hidden comment: CAP_0805_U_000_10)
C45  value 4.7uF  (hidden comment: CAP_4.7_uF)
C46  value 47uF  (hidden comment: CAP_47_uF)
C47  value 10µF  [CAP_0805]  (hidden comment: CAP_0805_U_010_00)
C48  value 12.0pF  (hidden comment: CAP_12_pF)
C49  value 1.8nF  (hidden comment: CAP_1.8_nF)
D1  Supplier Part Number 1: B540C-FDICT-ND  (hidden comment: B540C-13-F)
J1  S6009-09-ND
J2  609-3330-ND
L1  value 3.3uH  (hidden comment: INDCTR_3.3_uH)
L2  value 3.3uH  (hidden comment: INDCTR_3.3_uH)
L3  value 3.3uH  (hidden comment: INDCTR_3.3_uH)
L4  value 3.3uH  (hidden comment: INDCTR_3.3_uH)
L5  value 3.3uH  (hidden comment: INDCTR_3.3_uH)
L6  value 3.3uH  (hidden comment: INDCTR_3.3_uH)
L7  value 2.20uH  (hidden comment: INDCTR_2.20_uH)
P1  Supplier Part Number 1: 571-3-1775099-7  (hidden comment: 3-1775099-7)
P2  Supplier Part Number 1: 277-1711-ND  (hidden comment: 1984060)
P3  Supplier Part Number 1: 277-1711-ND  (hidden comment: 1984060)
R1  value 10K  (hidden comment: RES_10_KOhm)
R2  value 10K  (hidden comment: RES_10_KOhm)
R3  value 162K  (hidden comment: RES_162_KOhm)
R4  value 162K  (hidden comment: RES_162_KOhm)
R5  value 23.7K  (hidden comment: RES_23.7_KOhm)
R6  value 23.7K  (hidden comment: RES_23.7_KOhm)
R7  value 10K  (hidden comment: RES_10_KOhm)
R8  value 10K  (hidden comment: RES_10_KOhm)
R9  value 162K  (hidden comment: RES_162_KOhm)
R10  value 162K  (hidden comment: RES_162_KOhm)
R11  value 23.7K  (hidden comment: RES_23.7_KOhm)
R12  value 23.7K  (hidden comment: RES_23.7_KOhm)
R13  value 10K  (hidden comment: RES_10_KOhm)
R14  value 10K  (hidden comment: RES_10_KOhm)
R15  value 162K  (hidden comment: RES_162_KOhm)
R16  value 162K  (hidden comment: RES_162_KOhm)
R18  value 23.7K  (hidden comment: RES_23.7_KOhm)
R19  value 23.7K  (hidden comment: RES_23.7_KOhm)
R20  value 66.5K  (hidden comment: RES_66.5_KOhm)
R21  value 19.1K  (hidden comment: RES_19.1_KOhm)
R22  value 75.0K  (hidden comment: RES_75.0_KOhm)
R23  value 10.2K  (hidden comment: RES_10.2_KOhm)
U1  Supplier Part Number 1: 296-30033-1-ND  [SOIC127P600X170_HS-9N]  (hidden comment: TPS54427)
U2  Supplier Part Number 1: 296-30033-1-ND  [SOIC127P600X170_HS-9N]  (hidden comment: TPS54427)
U3  Supplier Part Number 1: 296-30033-1-ND  [SOIC127P600X170_HS-9N]  (hidden comment: TPS54427)
U4  Supplier Part Number 1: 296-30033-1-ND  [SOIC127P600X170_HS-9N]  (hidden comment: TPS54427)
U5  Supplier Part Number 1: 296-30033-1-ND  [SOIC127P600X170_HS-9N]  (hidden comment: TPS54427)
U6  Supplier Part Number 1: 296-30033-1-ND  [SOIC127P600X170_HS-9N]  (hidden comment: TPS54427)
U7  Supplier Part Number 1: 296-36231-5-ND  [SOIC127P600X170_HS-9N_5A]  (hidden comment: TPS54540)

### Nets
ATX_12V: C3.2 C4.2 C7.2 C11.2 C18.2 C19.2 C22.2 C25.2 C32.2 C33.2 C36.2 C39.2 C45.2 C47.2 J2.11(ATX_12V) P1.10 R1.1 R2.1 R7.1 R8.1 R13.1 R14.1 U1.8(VIN) U2.8(VIN) U3.8(VIN) U4.8(VIN) U5.8(VIN) U6.8(VIN) U7.2(VIN)  [also labelled 12V, Bulk_Cap, Bulk_Cap_1, Bulk_Cap_2, Bulk_Cap_3, Bulk_Cap_4, Bulk_Cap_5, Bulk_Cap_6, Pullup_1, Pullup_2, Pullup_3, Pullup_4, Pullup_5, Pullup_6, Src_Cap_1, Src_Cap_2, Src_Cap_3, Src_Cap_4, Src_Cap_5, Src_Cap_6, VIN, VIN_1, VIN_2, VIN_3, VIN_4, VIN_5, VIN_6]
GND: C3.1 C4.1 C7.1 C8.1 C10.1 C11.1 C12.1 C13.1 C14.1 C15.1 C18.1 C19.1 C22.1 C23.1 C24.1 C25.1 C26.1 C27.1 C28.1 C29.1 C32.1 C33.1 C36.1 C37.1 C38.1 C39.1 C40.1 C41.1 C42.1 C43.1 C45.1 C46.1 C47.1 C48.1 C49.1 D1.?2 J1.3(S1_GND) J1.6(S2_GND) J1.9(S3_GND) J1.12(S4_GND) J1.15(S5_GND) J1.18(S6_GND) J2.12(GND) P1.14 P1.15 R5.2 R6.2 R11.2 R12.2 R18.2 R19.2 R22.2 R23.1 U1.5(GND) U2.5(GND) U3.5(GND) U4.5(GND) U5.5(GND) U6.5(GND) U7.7(GND)  [also labelled PS_ON#]  [project net BAT_GND]
Vout: C46.2 L7.?2 R20.1  [also labelled 6V]
BOOT: C44.2 U7.1(BOOT)
COMP: C48.2 R21.1 U7.6(COMP)
DC_MOTOR1+: J2.1(DC1+) P2.1 ; off-sheet DC_MOTOR1+
DC_MOTOR1-: J2.2(DC1-) P2.2 ; off-sheet DC_MOTOR1-
DC_MOTOR2+: J2.3(DC2+) P2.3 ; off-sheet DC_MOTOR2+
DC_MOTOR2-: J2.4(DC2-) P2.4 ; off-sheet DC_MOTOR2-
DC_MOTOR3+: J2.5(DC3+) J2.6(DC3-) P2.5 P2.6 ; off-sheet DC_MOTOR3+, off-sheet DC_MOTOR3-  [also labelled DC_MOTOR3-]
DC_MOTOR4+: J2.7(DC4+) P3.1 ; off-sheet DC_MOTOR4+
DC_MOTOR4-: J2.8(DC4-) P3.2 ; off-sheet DC_MOTOR4-
DC_MOTOR5+: J2.9(DC5+) P3.3 ; off-sheet DC_MOTOR5+
DC_MOTOR5-: J2.10(DC5-) P3.4 ; off-sheet DC_MOTOR5-
EN_1: R1.2 U1.1(EN)
EN_2: R2.2 U2.1(EN)
EN_3: R7.2 U3.1(EN)
EN_4: R8.2 U4.1(EN)
EN_5: R13.2 U5.1(EN)
EN_6: R14.2 U6.1(EN)
Feedback_1: C5.2 R3.2 R5.1 U1.2(VFB)  [also labelled Rf_1]
Feedback_2: C6.2 R4.2 R6.1 U2.2(VFB)  [also labelled Rf_2]
Feedback_3: C20.2 R9.2 R11.1 U3.2(VFB)  [also labelled Rf_3]
Feedback_4: C21.2 R10.2 R12.1 U4.2(VFB)  [also labelled Rf_4]
Feedback_5: C34.2 R15.2 R18.1 U5.2(VFB)  [also labelled Rf_5]
Feedback_6: C35.2 R16.2 R19.1 U6.2(VFB)  [also labelled Rf_6]
Ri_1: C5.1 C10.2 J1.2(S1_V) L1.?2 R3.1  [also labelled Servo1_V]
Ri_2: C6.1 C13.2 J1.5(S2_V) L2.?2 R4.1  [also labelled Servo2_V]
Ri_3: C20.1 C24.2 J1.8(S3_V) L3.?2 R9.1  [also labelled Servo3_V]
Ri_4: C21.1 C27.2 J1.11(S4_V) L4.?2 R10.1  [also labelled Servo4_V]
Ri_5: C34.1 C38.2 J1.14(S5_V) L5.?2 R15.1  [also labelled Servo5_V]
Ri_6: C35.1 C41.2 J1.17(S6_V) L6.?2 R16.1  [also labelled Servo6_V]
RT/CLK: R22.1 U7.4(RT/CLK)
Servo1_CTL: J1.1(S1_CTL) ; off-sheet Servo1_CTL
Servo2_CTL: J1.4(S2_CTL) ; off-sheet Servo2_CTL
Servo3_CTL: J1.7(S3_CTL) ; off-sheet Servo3_CTL
Servo4_CTL: J1.10(S4_CTL) ; off-sheet Servo4_CTL
Servo5_CTL: J1.13(S5_CTL) ; off-sheet Servo5_CTL
Servo6_CTL: J1.16(S6_CTL) ; off-sheet Servo6_CTL
SS_1: C14.2 U1.4(SS)
SS_2: C15.2 U2.4(SS)
SS_3: C28.2 U3.4(SS)
SS_4: C29.2 U4.4(SS)
SS_5: C42.2 U5.4(SS)
SS_6: C43.2 U6.4(SS)
SW: C44.1 D1.?1 L7.?1 U7.8(SW)
SW_1: C1.1 L1.?1 U1.6(SW)
SW_2: C2.1 L2.?1 U2.6(SW)
SW_3: C16.1 L3.?1 U3.6(SW)
SW_4: C17.1 L4.?1 U4.6(SW)
SW_5: C30.1 L5.?1 U5.6(SW)
SW_6: C31.1 L6.?1 U6.6(SW)
VBST_1: C1.2 U1.7(VBST)
VBST_2: C2.2 U2.7(VBST)
VBST_3: C16.2 U3.7(VBST)
VBST_4: C17.2 U4.7(VBST)
VBST_5: C30.2 U5.7(VBST)
VBST_6: C31.2 U6.7(VBST)
VREG5_1: C8.2 U1.3(VREG5)
VREG5_2: C12.2 U2.3(VREG5)
VREG5_3: C23.2 U3.3(VREG5)
VREG5_4: C26.2 U4.3(VREG5)
VREG5_5: C37.2 U5.3(VREG5)
VREG5_6: C40.2 U6.3(VREG5)
NetC49_2: C49.2 R21.2
NetR20_2: R20.2 R23.2 U7.5(FB)

Not connected (* = marked no-connect by the designer): P1 1* 2* 3* 4* 5* 6* 7* 8* 9* 11* 12* 13* 16* 17* 18* 19* 20*; P2 7*; P3 5* 6* 7*; U7 3(EN)*

### Notes on the sheet
- Servo Voltage Regulators
- DC Motor Voltage Regulator
- Servo Wire Connector
- DC Motor Wire Connectors
- ATX Power Source
- Arm Voltage Testers
- DESIGN NOTE:
  PS_ON# signal must be shorted to ground for ATX power supply to operate.
- Labels drawn without touching a wire or pin: FB

### Library data of the parts
C1 C2 C16 C17 C30 C31 C44 = CAP_0805_U_000_10: CAP CER 0.1UF 50V Y5V 0805; Manufacturer: Yageo; Manufacturer Part Number: CC0805ZRY5V9BB104; Tolerance: -20%, +80%; Temperature Coefficient: Y5V (F); Supplier 1: Digi-Key; Supplier Part Number 1: 311-1361-1-ND; RoHS: RoHS Compliant; Category: Capacitors; Stock 1: 86324; Pricing 1: 1=0.1, 10=0.031, 25=0.022, 100=0.0144, 250=0.01176, 500=0.01004, 1000=0.00783 (USD); Packaging: Cut Tape (CT); Voltage - Rated: 50V; Mounting Type: Surface Mount, MLCC; Operating Temperature: -30°C ~ 85°C; Applications: General Purpose; Ratings: -; Package / Case: 0805 (2012 Metric); Size / Dimension: 0.079" L x 0.049" W (2.00mm x 1.25mm); Height - Seated (Max): -; Thickness (Max): 0.024" (0.60mm); Lead Spacing: -; Features: -; Lead Style: -; ComponentLink1URL: http://www.yageo.com/documents/recent/UPY-GPHC_Y5V_6.3V-to-50V_5_revised.pdf; ComponentLink1Description: http://www.yageo.com/documents/recent/UPY-GPHC_Y5V_6.3V-to-50V_5_revised.pdf
C3 C4 C18 C19 C32 C33 C47 = CAP_0805_U_010_00: as C?#1 on sheet 03 Arm Base Control Unit; Supplier 1: Digi-Key; Supplier Part Number 1: 1276-2402-1-ND; RoHS: RoHS Compliant; Category: Capacitors; Stock 1: 97192; Pricing 1: 1=0.2, 10=0.14, 25=0.1052, 50=0.0806, 100=0.0665, 500=0.0469, 1000=0.0385 (USD); Packaging: Cut Tape (CT); Voltage - Rated: 10V; Temperature Coefficient: X5R; Mounting Type: Surface Mount, MLCC; Operating Temperature: -55°C ~ 85°C; Applications: General Purpose; Ratings: -; Package / Case: 0805 (2012 Metric); Size / Dimension: 0.079" L x 0.049" W (2.00mm x 1.25mm); Height - Seated (Max): -; Thickness (Max): 0.037" (0.95mm); Lead Spacing: -; Features: -; Lead Style: -; ComponentLink1URL: http://media.digikey.com/pdf/Data%20Sheets/Samsung%20PDFs/CL21A106KPCLQNC_character.pdf; ComponentLink1Description: http://media.digikey.com/pdf/Data%20Sheets/Samsung%20PDFs/CL21A106KPCLQNC_character.pdf
C5 C6 C20 C21 C34 C35 = CAP_10_pF: CAP_10pF; Manufacturer: Kemet; Manufacturer Part Number: C0805C100M4GACTU; Capacitance: 10 pF; Tolerance: 20 %; Type: SMD MLCC C0G 10 - 250 VDC Commercial Grade; Voltage Rating DC: 16 VDC; Class: Class 1; Dielectric: C0G (NP0); Supplier 1: Mouser; RoHS: RoHS Compliant; Category: Multilayer Ceramic Capacitors MLCC - SMD/SMT; Stock 1: 24632; Pricing 1: 1=0.100, 10=0.028, 100=0.017, 1000=0.013, 4000=0.011, 8000=0.010, 24000=0.009, 48000=0.008, 100000=0.007 (USD); Height: -; Length: 2 mm; Package / Case: 0805 (2012 metric); Packaging: Reel; Product: General Type MLCCs; Series: C0805C; Termination Style: SMD/SMT; Voltage Rating AC: -; Width: 1.2 mm; Brand: Kemet; Case Code - in: 0805; Case Code - mm: 2012; Maximum Operating Temperature: + 125 C; Minimum Operating Temperature: - 55 C; Product Category: 0805 SMD Ceramic Chip Capacitors; Standard Pack Qty: 4000; RoHS - Mouser: Y; Minimum Order Quantity: 1; Reeling: True; ComponentLink1URL: http://www.mouser.com/ds/2/212/KEM_C1003_C0G_SMD-356956.pdf; ComponentLink1Description: http://www.mouser.com/ds/2/212/KEM_C1003_C0G_SMD-356956.pdf; Supplier Part Number 1: 80-C0805C100M4G
C7 C11 C22 C25 C36 C39 = CAP_22_uF: CAP 22uF; Manufacturer: AVX; Manufacturer Part Number: 1210YD226KAT2A; Capacitance: 22 F; Capacitance Tolerance: 10%; Dielectric Characteristic: X5; Voltage Rating: 16; Ceramic Capacitor Case: 1210 [3225 Metric]; Supplier 1: Newark; RoHS: YES; Stock 1: 759; Pricing 1: 1=0.2, 10=0.2, 100=0.2, 250=0.2, 500=0.2 (USD); Product Range: -; Packaging: Cut Tape; ComponentLink1URL: http://www.avx.com/docs/Catalogs/cpack.pdf; ComponentLink1Description: http://www.avx.com/docs/Catalogs/cpack.pdf; ComponentLink2URL: http://www.farnell.com/datasheets/1796776.pdf; ComponentLink2Description: http://www.farnell.com/datasheets/1796776.pdf; Supplier Part Number 1: 84K8411
C8 C12 C23 C26 C37 C40 = CAP_0805_U_001_00: CAP CER 1UF 16V Y5V 0805; Manufacturer: Yageo; Manufacturer Part Number: CC0805ZRY5V7BB105; Tolerance: -20%, +80%; Temperature Coefficient: Y5V (F); Supplier 1: Digi-Key; Supplier Part Number 1: 311-1457-1-ND; RoHS: RoHS Compliant; Category: Capacitors; Stock 1: 136023; Pricing 1: 1=0.1, 10=0.043, 25=0.0304, 100=0.0197, 250=0.01616, 500=0.01382, 1000=0.01077 (USD); Packaging: Cut Tape (CT); Voltage - Rated: 16V; Mounting Type: Surface Mount, MLCC; Operating Temperature: -30°C ~ 85°C; Applications: General Purpose; Ratings: -; Package / Case: 0805 (2012 Metric); Size / Dimension: 0.079" L x 0.049" W (2.00mm x 1.25mm); Height - Seated (Max): -; Thickness (Max): 0.037" (0.95mm); Lead Spacing: -; Features: -; Lead Style: -; ComponentLink1URL: http://www.yageo.com/documents/recent/UPY-GPHC_Y5V_6.3V-to-50V_5_revised.pdf; ComponentLink1Description: http://www.yageo.com/documents/recent/UPY-GPHC_Y5V_6.3V-to-50V_5_revised.pdf
C10 C13 C24 C27 C38 C41 C46 = CAP_47_uF: CAP 47uF; Manufacturer: TDK Corporation; Manufacturer Part Number: C3216X5R1E476M160AC; Capacitance: 47µF; Tolerance: ±20%; Voltage - Rated: 25V; Temperature Coefficient: X5R; Supplier 1: Digi-Key; RoHS: RoHS Compliant; Category: Capacitors; Stock 1: 119209; Pricing 1: 1=1.25, 10=1.025, 100=0.725, 250=0.6, 500=0.5375, 1000=0.475 (USD); Packaging: Cut Tape (CT); Mounting Type: Surface Mount, MLCC; Operating Temperature: -55°C ~ 85°C; Applications: General Purpose; Ratings: -; Package / Case: 1206 (3216 Metric); Size / Dimension: 0.126" L x 0.063" W (3.20mm x 1.60mm); Height - Seated (Max): -; Thickness (Max): -; Lead Spacing: -; Features: -; Lead Style: -; ComponentLink1URL: https://product.tdk.com/info/en/catalog/datasheets/mlcc_commercial_general_en.pdf; ComponentLink1Description: https://product.tdk.com/info/en/catalog/datasheets/mlcc_commercial_general_en.pdf; Supplier Part Number 1: 445-8047-1-ND
C14 C15 C28 C29 C42 C43 = CAP_8.2_nF: CAP 8.2; Manufacturer: Murata Electronics; Manufacturer Part Number: GRM033R61A822KA01D; Capacitance: 8200 pF; Tolerance: 10 %; Type: General Purpose MLCC; Voltage Rating DC: 10 VDC; Dielectric: X5R; Supplier 1: Mouser; RoHS: RoHS Compliant; Category: Multilayer Ceramic Capacitors MLCC - SMD/SMT; Stock 1: 45161; Pricing 1: 1=0.100, 10=0.014, 100=0.009, 1000=0.007, 2500=0.006, 15000=0.004, 90000=0.003 (USD); Height: 0.3 mm; Length: 0.6 mm; Package / Case: 0201 (0603 metric); Packaging: Reel; Product: General Type MLCCs; Series: GRM; Termination Style: SMD/SMT; Width: 0.3 mm; Brand: Murata Electronics; Case Code - in: 0201; Case Code - mm: 0603; Maximum Operating Temperature: + 85 C; Minimum Operating Temperature: - 55 C; Standard Pack Qty: 15000; RoHS - Mouser: Y; Minimum Order Quantity: 1; Reeling: True; ComponentLink1URL: http://www.mouser.com/ds/2/281/c02e-2905.pdf; ComponentLink1Description: http://www.mouser.com/ds/2/281/c02e-2905.pdf; Supplier Part Number 1: 81-GRM033R61A822KA1D
C45 = CAP_4.7_uF: CAP_4.7uF; Manufacturer: Kemet; Manufacturer Part Number: C1206C475K4PACTU; Capacitance: 4.7µF; Tolerance: ±10%; Voltage - Rated: 16V; Temperature Coefficient: X5R; Supplier 1: Digi-Key; RoHS: RoHS Compliant; Category: Capacitors; Stock 1: 42893; Pricing 1: 1=0.3, 10=0.205, 50=0.124, 100=0.1042, 250=0.08432, 500=0.0744, 1000=0.06324 (USD); Packaging: Cut Tape (CT); Mounting Type: Surface Mount, MLCC; Operating Temperature: -55°C ~ 85°C; Applications: General Purpose; Ratings: -; Package / Case: 1206 (3216 Metric); Size / Dimension: 0.126" L x 0.063" W (3.20mm x 1.60mm); Height - Seated (Max): -; Thickness (Max): 0.071" (1.80mm); Lead Spacing: -; Features: -; Lead Style: -; ComponentLink1URL: http://www.kemet.com/docfinder?Partnumber=C1206C475K4PACTU; ComponentLink1Description: http://www.kemet.com/docfinder?Partnumber=C1206C475K4PACTU; Supplier Part Number 1: 399-1265-1-ND
C48 = CAP_12_pF: CAP_12pF; Manufacturer: Yageo; Manufacturer Part Number: CC0805JRNPO9BN120; Capacitance: 12pF; Tolerance: ±5%; Voltage - Rated: 50V; Temperature Coefficient: C0G, NP0; Supplier 1: Digi-Key; RoHS: RoHS Compliant; Category: Capacitors; Stock 1: 44000; Pricing 1: 4000=0.0128, 8000=0.01169, 12000=0.01113, 28000=0.01057, 100000=0.00765 (USD); Packaging: Tape & Reel (TR); Mounting Type: Surface Mount, MLCC; Operating Temperature: -55°C ~ 125°C; Applications: General Purpose; Ratings: -; Package / Case: 0805 (2012 Metric); Size / Dimension: 0.079" L x 0.049" W (2.00mm x 1.25mm); Height - Seated (Max): -; Thickness (Max): 0.024" (0.60mm); Lead Spacing: -; Features: -; Lead Style: -; ComponentLink1URL: http://www.yageo.com/documents/recent/UPY-GP_NP0_16V-to-50V_10.pdf; ComponentLink1Description: http://www.yageo.com/documents/recent/UPY-GP_NP0_16V-to-50V_10.pdf; Supplier Part Number 1: 311-1100-2-ND
C49 = CAP_1.8_nF: CAP_1.8nF; Manufacturer: Murata Electronics North America; Manufacturer Part Number: GRM033R71A182KA01D; Capacitance: 1800pF; Tolerance: ±10%; Voltage - Rated: 10V; Temperature Coefficient: X7R; Supplier 1: Digi-Key; RoHS: RoHS Compliant; Category: Capacitors; Stock 1: 15144; Pricing 1: 1=0.1, 10=0.025, 50=0.0136, 100=0.0116, 250=0.00944, 500=0.00808, 1000=0.0063, 5000=0.00525 (USD); Packaging: Cut Tape (CT); Mounting Type: Surface Mount, MLCC; Operating Temperature: -55°C ~ 125°C; Applications: General Purpose; Ratings: -; Package / Case: 0201 (0603 Metric); Size / Dimension: 0.024" L x 0.012" W (0.60mm x 0.30mm); Height - Seated (Max): -; Thickness (Max): 0.013" (0.33mm); Lead Spacing: -; Features: -; Lead Style: -; ComponentLink1URL: http://www.murata.com/~/media/webrenewal/support/library/catalog/products/capacitor/mlcc/c02e.pdf; ComponentLink1Description: http://www.murata.com/~/media/webrenewal/support/library/catalog/products/capacitor/mlcc/c02e.pdf; Supplier Part Number 1: 490-8160-1-ND
D1 = B540C-13-F: 5A pwr regulator diode; Manufacturer: Diodes Incorporated; Diode Type: Schottky; Voltage - DC Reverse (Vr) (Max): 40V; Voltage - Forward (Vf) (Max) @ If: 550mV @ 5A; Speed: Fast Recovery =< 500ns, > 200mA (Io); Current - Reverse Leakage @ Vr: 500µA @ 40V; Capacitance @ Vr, F: 300pF @ 4V, 1MHz; Supplier 1: Digi-Key; Manufacturer Part Number: B540C-13-F; RoHS: RoHS Compliant; Category: Discrete Semiconductor Products; Stock 1: 29411; Pricing 1: 1=0.5, 10=0.426, 100=0.3179, 500=0.2497, 1000=0.1925 (USD); Packaging: Cut Tape (CT); Current - Average Rectified (Io): 5A; Reverse Recovery Time (trr): -; Mounting Type: Surface Mount; Package / Case: DO-214AB, SMC; Supplier Device Package: SMC; Operating Temperature - Junction: -55°C ~ 125°C; ComponentLink1URL: http://www.diodes.com/_files/datasheets/ds13012.pdf; ComponentLink1Description: http://www.diodes.com/_files/datasheets/ds13012.pdf
J1 = S6009-09-ND: Connection for Servos to PCB; Manufacturer: Sullins Connector Solutions; Manufacturer Part Number: NRPN092MAMS-RC; Connector Type: Header, Unshrouded; Number of Positions: 18; Number of Positions Loaded: All; Pitch: 0.079" (2.00mm); Supplier 1: Digi-Key; RoHS: RoHS Compliant; Category: Connectors, Interconnects; Stock 1: 2299; Pricing 1: 1=1.9, 10=1.57, 25=1.4716, 50=1.308, 100=1.1772, 250=1.08564, 500=0.981, 1000=0.86982, 2500=0.83385 (USD); Packaging: Bulk; Contact Type: Male Pin; Number of Rows: 2; Row Spacing: 0.079" (2.00mm); Contact Mating Length: 0.141" (3.60mm); Mounting Type: Surface Mount; Termination: Solder; Fastening Type: -; Features: -; Contact Finish: Gold; Contact Finish Thickness: Flash; Color: Black; ComponentLink1URL: http://sullinscorp.com/drawings/91_NRPNxx2MAMx-RC,_10495-D.pdf; ComponentLink1Description: http://sullinscorp.com/drawings/91_NRPNxx2MAMx-RC,_10495-D.pdf; Supplier Part Number 1: S6009-09-ND
J2 = 609-3330-ND: Arm Voltage Testers; Manufacturer: Amphenol FCI; Manufacturer Part Number: 68016-412HLF; Connector Type: Header, Unshrouded; Number of Positions: 12; Number of Positions Loaded: All; Pitch: 0.100" (2.54mm); Supplier 1: Digi-Key; RoHS: RoHS Compliant; Category: Connectors, Interconnects; Stock 1: 1213; Pricing 1: 1=0.51, 10=0.483, 25=0.4344, 50=0.3862, 100=0.3701, 250=0.33788, 500=0.3218, 1000=0.26549, 2500=0.24135 (USD); Packaging: Bulk; Contact Type: Male Pin; Number of Rows: 1; Row Spacing: -; Contact Mating Length: 0.230" (5.84mm); Mounting Type: Through Hole, Right Angle; Termination: Solder; Fastening Type: -; Features: -; Contact Finish: Tin; Contact Finish Thickness: 100µin (2.54µm); Color: Black; ComponentLink1URL: http://portal.fciconnect.com/Comergent//fci/drawing/68015.pdf; ComponentLink1Description: http://portal.fciconnect.com/Comergent//fci/drawing/68015.pdf; Supplier Part Number 1: 609-3330-ND
L1-L6 = INDCTR_3.3_uH: Inductor 3.3uH; Manufacturer: Bourns; Manufacturer Part Number: SDR1307-3R3ML; Maximum DC Current: 7.5 A; Maximum DC Resistance: 8.7 mOhms; Q Minimum: 26; Self Resonant Frequency: 38 MHz; Tolerance: 20 %; Supplier 1: Mouser; RoHS: RoHS Compliant; Category: Fixed Inductors; Stock 1: 344; Pricing 1: 1=0.830, 10=0.728, 50=0.624, 100=0.593, 250=0.507, 400=0.437, 800=0.346, 2400=0.337 (USD); Diameter: 13 mm; Height: 7 mm; Inductance: 3.3 uH; Packaging: Reel; Product: Power Inductors; Series: SDR1307; Termination Style: SMD/SMT; Width: 13 mm; Brand: Bourns; Mounting Style: SMD/SMT; Product Category: Inductors; Standard Pack Qty: 400; RoHS - Mouser: Y; Minimum Order Quantity: 1; Reeling: True; ComponentLink1URL: http://www.mouser.com/ds/2/54/DR1307-778385.pdf; ComponentLink1Description: http://www.mouser.com/ds/2/54/DR1307-778385.pdf; Supplier Part Number 1: 652-SDR1307-3R3ML
L7 = INDCTR_2.20_uH: Inductor 2.2uH; Manufacturer: Bourns Inc.; Manufacturer Part Number: SRN8040-2R2Y; Type: Wirewound; Material - Core: Ferrite; Inductance: 2.2µH; Tolerance: ±30%; Current Rating: 6.3A; Current - Saturation: 7.4A; Shielding: Shielded; DC Resistance (DCR): 13 mOhm Max; Q @ Freq: 13 @ 7.96MHz; Frequency - Self Resonant: 40MHz; Frequency - Test: 100kHz; Supplier 1: Digi-Key; RoHS: RoHS Compliant; Category: Inductors, Coils, Chokes; Stock 1: 3527; Pricing 1: 1=0.58, 10=0.512, 25=0.48, 50=0.416, 100=0.384, 250=0.3648, 500=0.3328 (USD); Packaging: Cut Tape (CT); Ratings: -; Operating Temperature: -40°C ~ 125°C; Mounting Type: Surface Mount; Package / Case: Nonstandard; Size / Dimension: 0.315" L x 0.315" W (8.00mm x 8.00mm); Height - Seated (Max): 0.157" (4.00mm); ComponentLink1URL: http://www.bourns.com/docs/Product-Datasheets/SRN8040.pdf; ComponentLink1Description: http://www.bourns.com/docs/Product-Datasheets/SRN8040.pdf; Supplier Part Number 1: SRN8040-2R2YCT-ND
P1 = 3-1775099-7: TE Connectivity AMP Connectors; Manufacturer: TE Connectivity / AMP; Supplier 1: Mouser; Manufacturer Part Number: 3-1775099-7; RoHS: RoHS Compliant; Category: Power to the Board; Stock 1: 0; Pricing 1: 6000=0.383 (USD); Packaging: Bulk; Brand: TE Connectivity / AMP; RoHS - Mouser: Y; Minimum Order Quantity: 6000; Reeling: False; ComponentLink1URL: http://www.mouser.com/ds/2/418/NG_CD_1775099_F-617773.pdf; ComponentLink1Description: http://www.mouser.com/ds/2/418/NG_CD_1775099_F-617773.pdf; Value: 3-1775099-7
P2 P3 = 1984060: Phoenix Contact 1984060; Number of Positions: 7; Number of Levels: 1; Pitch: 0.138" (3.50mm); Plug Wire Entry: 90° and 180°; Current - IEC: 8A; Voltage - IEC: 400V; Current - UL: 10A; Voltage - UL: 300V; Wire Gauge or Range - AWG: 16-26 AWG; Wire Gauge or Range - mm²: 0.2-1.5mm²; Supplier 1: Digi-Key; Manufacturer: Phoenix Contact; Manufacturer Part Number: 1984060; RoHS: RoHS Compliant; Category: Connectors, Interconnects; Stock 1: 1429; Pricing 1: 1=1.38, 10=1.32, 50=1.284, 100=1.2, 250=1.104, 500=1.02 (USD); Packaging: Bulk; Type: Plug for Unshrouded Header; Positions Per Level: 7; Header Orientation: -; Termination Style: Screw - Clamping Yoke (Tension Sleeve); Mounting Type: Free Hanging (In-Line); Color: Green; Operating Temperature: -; Contact Mating Finish: Tin; Features: -; ComponentLink1URL: http://media.digikey.com/pdf/Data%20Sheets/Phoenix%20Contact%20PDFs/Combicon%20Compact%20Series.pdf; ComponentLink1Description: http://media.digikey.com/pdf/Data%20Sheets/Phoenix%20Contact%20PDFs/Combicon%20Compact%20Series.pdf; Value: 1984060
R1 R2 R7 R8 R13 R14 = RES_10_KOhm: RES 10K; Manufacturer: Vishay Dale; Manufacturer Part Number: CRCW040210K0FKED; Tolerance: ±1%; Power (Watts): 0.063W, 1/16W; Temperature Coefficient: ±100ppm/°C; Supplier 1: Digi-Key; RoHS: RoHS Compliant; Category: Resistors; Stock 1: 2360512; Pricing 1: 10=0.083, 50=0.0444, 200=0.0255, 1000=0.0174 (USD); Packaging: Cut Tape (CT); Resistance (Ohms): 10k; Composition: Thick Film; Features: Automotive AEC-Q200; Operating Temperature: -55°C ~ 155°C; Package / Case: 0402 (1005 Metric); Supplier Device Package: 0402 (1005 Metric); Size / Dimension: 0.039" L x 0.020" W (1.00mm x 0.50mm); Height: 0.016" (0.40mm); Number of Terminations: 2; ComponentLink1URL: http://www.vishay.com/docs/20035/dcrcwe3.pdf; ComponentLink1Description: http://www.vishay.com/docs/20035/dcrcwe3.pdf; Supplier Part Number 1: 541-10.0KLCT-ND
R3 R4 R9 R10 R15 R16 = RES_162_KOhm: RES 162K; Manufacturer: Vishay Dale; Manufacturer Part Number: CRCW0402162KFKED; Tolerance: ±1%; Power (Watts): 0.063W, 1/16W; Temperature Coefficient: ±100ppm/°C; Supplier 1: Digi-Key; RoHS: RoHS Compliant; Category: Resistors; Stock 1: 203075; Pricing 1: 10=0.083, 50=0.0444, 200=0.0255, 1000=0.0174 (USD); Packaging: Cut Tape (CT); Resistance (Ohms): 162k; Composition: Thick Film; Features: Automotive AEC-Q200; Operating Temperature: -55°C ~ 155°C; Package / Case: 0402 (1005 Metric); Supplier Device Package: 0402 (1005 Metric); Size / Dimension: 0.039" L x 0.020" W (1.00mm x 0.50mm); Height: 0.016" (0.40mm); Number of Terminations: 2; ComponentLink1URL: http://www.vishay.com/docs/20035/dcrcwe3.pdf; ComponentLink1Description: http://www.vishay.com/docs/20035/dcrcwe3.pdf; Supplier Part Number 1: 541-162KLCT-ND
R5 R6 R11 R12 R18 R19 = RES_23.7_KOhm: RES 23.7K; Manufacturer: Vishay Dale; Manufacturer Part Number: CRCW040223K7FKED; Tolerance: ±1%; Power (Watts): 0.063W, 1/16W; Temperature Coefficient: ±100ppm/°C; Supplier 1: Digi-Key; RoHS: RoHS Compliant; Category: Resistors; Stock 1: 58875; Pricing 1: 10=0.083, 50=0.0444, 200=0.0255, 1000=0.0174 (USD); Packaging: Cut Tape (CT); Resistance (Ohms): 23.7k; Composition: Thick Film; Features: Automotive AEC-Q200; Operating Temperature: -55°C ~ 155°C; Package / Case: 0402 (1005 Metric); Supplier Device Package: 0402 (1005 Metric); Size / Dimension: 0.039" L x 0.020" W (1.00mm x 0.50mm); Height: 0.016" (0.40mm); Number of Terminations: 2; ComponentLink1URL: http://www.vishay.com/docs/20035/dcrcwe3.pdf; ComponentLink1Description: http://www.vishay.com/docs/20035/dcrcwe3.pdf; Supplier Part Number 1: 541-23.7KLCT-ND
R20 = RES_66.5_KOhm: RES_66.5K; Manufacturer: Vishay / Dale; Manufacturer Part Number: CRCW040266K5FKED; Power Rating: 63 mW; Resistance: 66.5 kOhms; Temperature Coefficient: 100 PPM / K; Tolerance: 1 %; Voltage Rating: 50 V; Supplier 1: Mouser; RoHS: RoHS Compliant By Exemption; Category: Thick Film Resistors - SMD; Stock 1: 32930; Pricing 1: 1=0.100, 10=0.045, 100=0.026, 1000=0.018, 10000=0.006, 30000=0.005, 50000=0.004, 250000=0.003 (USD); Height: 0.35 mm; Length: 1 mm; Operating Temperature Range: - 55 C to + 155 C; Package / Case: 0402 (1005 metric); Packaging: Reel; Product: Thick Film Resistors SMD; Series: CRCW; Termination Style: SMD/SMT; Width: 0.5 mm; Brand: Vishay / Dale; Case Code - in: 0402; Case Code - mm: 1005; Product Category: 0402 Thick Film Chip Resistors; Standard Pack Qty: 10000; RoHS - Mouser: E; Minimum Order Quantity: 1; Reeling: True; ComponentLink1URL: http://www.mouser.com/ds/2/427/dcrcwe3-109170.pdf; ComponentLink1Description: http://www.mouser.com/ds/2/427/dcrcwe3-109170.pdf; Supplier Part Number 1: 71-CRCW0402-66.5K-E3
R21 = RES_19.1_KOhm: RES_19.1K; Manufacturer: Vishay / Dale; Manufacturer Part Number: CRCW040219K1FKED; Power Rating: 63 mW; Resistance: 19.1 kOhms; Temperature Coefficient: 100 PPM / K; Tolerance: 1 %; Voltage Rating: 50 V; Supplier 1: Mouser; RoHS: RoHS Compliant By Exemption; Category: Thick Film Resistors - SMD; Stock 1: 27834; Pricing 1: 1=0.100, 10=0.045, 100=0.026, 1000=0.018, 10000=0.006, 30000=0.005, 50000=0.004, 250000=0.003 (USD); Height: 0.35 mm; Length: 1 mm; Operating Temperature Range: - 55 C to + 155 C; Package / Case: 0402 (1005 metric); Packaging: Reel; Product: Thick Film Resistors SMD; Series: CRCW; Termination Style: SMD/SMT; Width: 0.5 mm; Brand: Vishay / Dale; Case Code - in: 0402; Case Code - mm: 1005; Product Category: 0402 Thick Film Chip Resistors; Standard Pack Qty: 10000; RoHS - Mouser: E; Minimum Order Quantity: 1; Reeling: True; ComponentLink1URL: http://www.mouser.com/ds/2/427/dcrcwe3-109170.pdf; ComponentLink1Description: http://www.mouser.com/ds/2/427/dcrcwe3-109170.pdf; Supplier Part Number 1: 71-CRCW0402-19.1K-E3
R22 = RES_75.0_KOhm: RES_75K; Manufacturer: Vishay / Dale; Manufacturer Part Number: CRCW040275K0FKED; Power Rating: 63 mW; Resistance: 75 kOhms; Temperature Coefficient: 100 PPM / K; Tolerance: 1 %; Voltage Rating: 50 V; Supplier 1: Mouser; RoHS: RoHS Compliant By Exemption; Category: Thick Film Resistors - SMD; Stock 1: 73431; Pricing 1: 1=0.100, 10=0.045, 100=0.026, 1000=0.018, 10000=0.006, 30000=0.005, 50000=0.004, 250000=0.003 (USD); Height: 0.35 mm; Length: 1 mm; Operating Temperature Range: - 55 C to + 155 C; Package / Case: 0402 (1005 metric); Packaging: Reel; Product: Thick Film Resistors SMD; Series: CRCW; Termination Style: SMD/SMT; Width: 0.5 mm; Brand: Vishay / Dale; Case Code - in: 0402; Case Code - mm: 1005; Product Category: 0402 Thick Film Chip Resistors; Standard Pack Qty: 10000; RoHS - Mouser: E; Minimum Order Quantity: 1; Reeling: True; ComponentLink1URL: http://www.mouser.com/ds/2/427/dcrcwe3-109170.pdf; ComponentLink1Description: http://www.mouser.com/ds/2/427/dcrcwe3-109170.pdf; Supplier Part Number 1: 71-CRCW0402-75K-E3
R23 = RES_10.2_KOhm: RES_10.2K; Manufacturer: Vishay / Dale; Manufacturer Part Number: CRCW040210K2FKED; Power Rating: 63 mW; Resistance: 10.2 kOhms; Temperature Coefficient: 100 PPM / K; Tolerance: 1 %; Voltage Rating: 50 V; Supplier 1: Mouser; RoHS: RoHS Compliant By Exemption; Category: Thick Film Resistors - SMD; Stock 1: 30506; Pricing 1: 1=0.100, 10=0.045, 100=0.026, 1000=0.018, 10000=0.006, 30000=0.005, 50000=0.004, 250000=0.003 (USD); Height: 0.35 mm; Length: 1 mm; Operating Temperature Range: - 55 C to + 155 C; Package / Case: 0402 (1005 metric); Packaging: Reel; Product: Thick Film Resistors SMD; Series: CRCW; Termination Style: SMD/SMT; Width: 0.5 mm; Brand: Vishay / Dale; Case Code - in: 0402; Case Code - mm: 1005; Product Category: 0402 Thick Film Chip Resistors; Standard Pack Qty: 10000; RoHS - Mouser: E; Minimum Order Quantity: 1; Reeling: True; ComponentLink1URL: http://www.mouser.com/ds/2/427/dcrcwe3-109170.pdf; ComponentLink1Description: http://www.mouser.com/ds/2/427/dcrcwe3-109170.pdf; Supplier Part Number 1: 71-CRCW0402-10.2K-E3
U1-U6 = TPS54427: 4A Regulator for Servos; Manufacturer: Texas Instruments; Manufacturer Part Number: TPS54427DDAR; Function: Step-Down; Output Configuration: Positive; Topology: Buck; Output Type: Adjustable; Number of Outputs: 1; Voltage - Input (Min): 4.5V; Voltage - Input (Max): 18V; Voltage - Output (Min/Fixed): 0.76V; Voltage - Output (Max): 7V; Frequency - Switching: 650kHz; Synchronous Rectifier: Yes; Supplier 1: Digi-Key; RoHS: RoHS Compliant; Category: Integrated Circuits (ICs); Stock 1: 7754; Pricing 1: 1=2.07, 10=1.856, 100=1.4892, 500=1.224, 1000=1.0132 (USD); Packaging: Cut Tape (CT); Current - Output: 4A; Operating Temperature: -40°C ~ 85°C (TA); Mounting Type: Surface Mount; Package / Case: 8-SOIC (0.154", 3.90mm Width) Exposed Pad; Supplier Device Package: 8-SO PowerPad; ComponentLink1URL: http://www.ti.com/lit/ds/symlink/tps54427.pdf; ComponentLink1Description: http://www.ti.com/lit/ds/symlink/tps54427.pdf; Value: TPS54427
U7 = TPS54540: 5A Regulator for DC Motors; Manufacturer: Texas Instruments; Manufacturer Part Number: TPS54540DDA; Function: Step-Down; Output Configuration: Positive; Topology: Buck, Split Rail; Output Type: Adjustable; Number of Outputs: 1; Voltage - Input (Min): 4.5V; Voltage - Input (Max): 42V; Voltage - Output (Min/Fixed): 0.8V; Voltage - Output (Max): 41.1V; Frequency - Switching: 100kHz ~ 2.5MHz; Synchronous Rectifier: No; Supplier 1: Digi-Key; RoHS: RoHS Compliant; Category: Integrated Circuits (ICs); Stock 1: 1735; Pricing 1: 1=5.58, 10=5.012, 100=4.1067, 500=3.49596, 1000=2.6325 (USD); Packaging: Tube; Current - Output: 5A; Operating Temperature: -40°C ~ 150°C (TJ); Mounting Type: Surface Mount; Package / Case: 8-SOIC (0.154", 3.90mm Width) Exposed Pad; Supplier Device Package: 8-SO PowerPad; ComponentLink1URL: http://www.ti.com/lit/ds/symlink/tps54540.pdf; ComponentLink1Description: http://www.ti.com/lit/ds/symlink/tps54540.pdf; Value: TPS54540